# EAGLE design f1_Not (EAGLE 7.2.0)
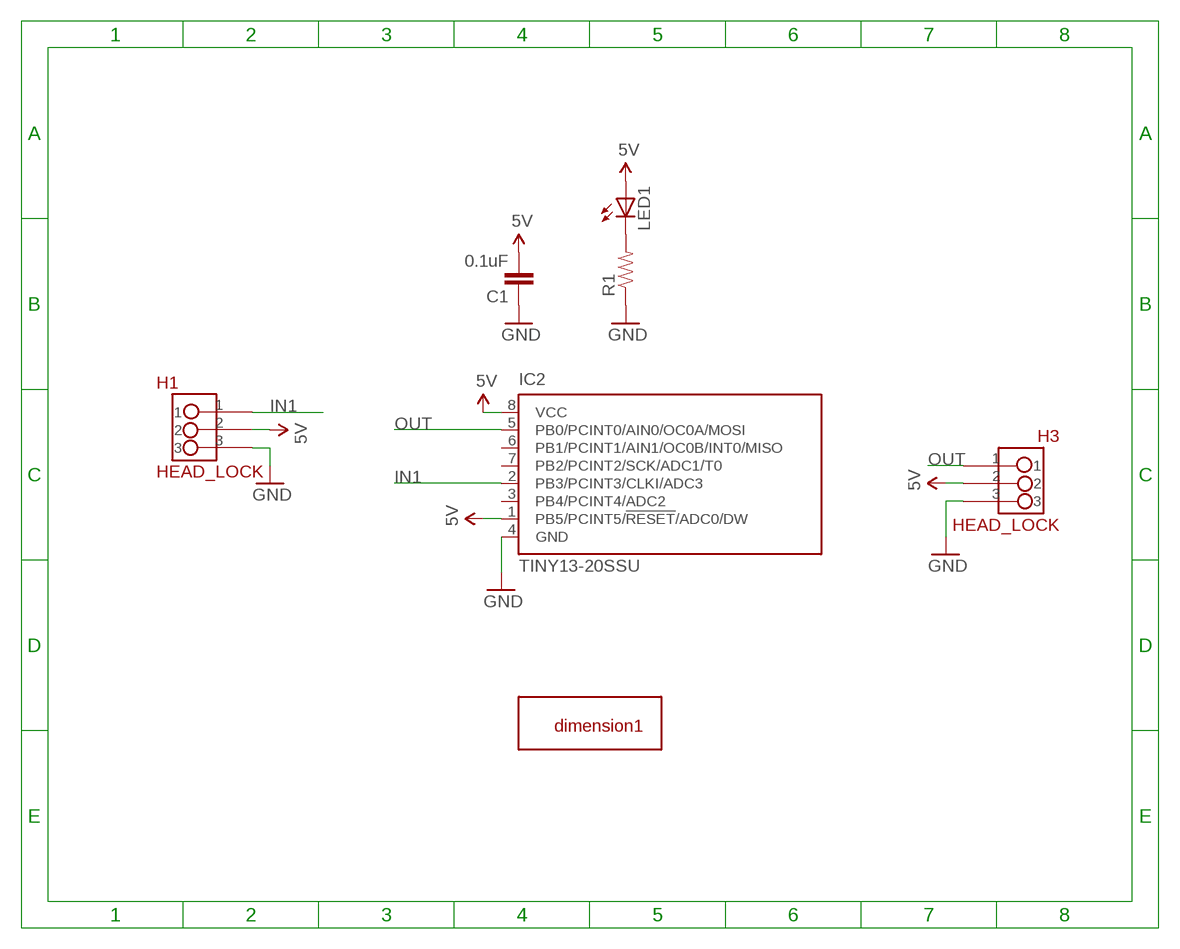
[diagram p0: schematic, sheet 1]

## Parts
C1  0.1uF  0.1UF-25V(+80/-20%)(0603)  [0603-CAP]
H1  HEAD_LOCK  [HEAD_LOCK]
H3  HEAD_LOCK  [HEAD_LOCK]
IC2  TINY13-20SSU  [8S1]
LED1  LEDSML0603  [SML0603]
R1  RESISTOR0603-RES  [0603-RES]
U$1  DIMENSION1  [DIMENSION1]

## Nets
5V: C1.2 H1.2 H3.2 IC2.1(PB5/PCINT5/!RESET!/ADC0/DW) IC2.8(VCC) LED1.A
GND: C1.1 H1.3 H3.3 IC2.4(GND) R1.1
IN1: H1.1 IC2.2(PB3/PCINT3/CLKI/ADC3)
N$1: LED1.C R1.2
OUT: H3.1 IC2.5(PB0/PCINT0/AIN0/OC0A/MOSI)
Unconnected: IC2.3(PB4/PCINT4/ADC2) IC2.6(PB1/PCINT1/AIN1/OC0B/INT0/MISO) IC2.7(PB2/PCINT2/SCK/ADC1/T0)

## Library data of the parts
C1 = SparkFun-Capacitors:0.1UF-25V(+80/-20%)(0603): CAP-00810 Ceramic Standard decoupling cap; PROD_ID: CAP-00810
H1 H3 = HEAD_LOCK:HEAD_LOCK: 带锁的排座
IC2 = atmel:TINY13: 8-bit AVR Microcontroller with 1K Bytes In-System Programmable Flash Source: http://www.atmel.com/dyn/resources/prod_documents/2535S.pdf; MPN: ATTINY13-20SSU; OC_FARNELL: 1455133; OC_NEWARK: 58M3771
LED1 = led:LED: LED OSRAM: - CHIPLED LG R971, LG N971, LY N971, LG Q971, LY Q971, LO R971, LY R971 LH N974, LH R974 LS Q976, LO Q976, LY Q976 LO Q996 - Hyper CHIPLED LW Q18S LB Q993, LB Q99A, LB R99A - SideLED LS A670, LO A670, LY A670, LG A670, LP A670 LB A673, LV A673, LT A673, LW A673 LH A674 LY A675 LS A676, LA A676, LO A676, LY A676, LW A676 LS A679, LY A679, LG A679 - Hyper Micro SIDELED® LS Y876, LA Y876, LO Y876, LY Y876 LT Y87S - SmartLED LW L88C, LW L88S LB L89C, LB L89S, LG L890 LS L89K, LO L89K, LY L89K LS L896, LA L896, LO L896, LY L896 - TOPLED LS T670, LO T670, LY T670, LG T670, LP T670 LSG T670, LSP T670, LSY T670, LOP T670, LYG T670 LG T671, LOG T671, LSG T671 LB T673, LV T673, LT T673, LW T673 LH T674 LS T676, LA T676, LO T676, LY T676, LB T676, LH T676, LSB T676, LW T676 LB T67C, LV T67C, LT T67C, LS T67K, LO T67K, LY T67K, LW E67C LS E67B, LA E67B, LO E67B, LY E67B, LB E67C, LV E67C, LT E67C LW T67C LS T679, LY T679, LG T679 LS T770, LO T770, LY T770, LG T770, LP T770 LB T773, LV T773, LT T773, LW T773 LH T774 LS E675, LA E675, LY E675, LS T675 LS T776, LA T776, LO T776, LY T776, LB T776 LHGB T686 LT T68C, LB T68C - Hyper Mini TOPLED® LB M676 - Mini TOPLED Santana® LG M470 LS M47K, LO M47K, LY M47K Source: http://www.osram.convergy.de LUXEON: - LUMILED® LXK2-PW12-R00, LXK2-PW12-S00, LXK2-PW14-U00, LXK2-PW14-V00 LXK2-PM12-R00, LXK2-PM12-S00, LXK2-PM14-U00 LXK2-PE12-Q00, LXK2-PE12-R00, LXK2-PE12-S00, LXK2-PE14-T00, LXK2-PE14-U00 LXK2-PB12-K00, LXK2-PB12-L00, LXK2-PB12-M00, LXK2-PB14-N00, LXK2-PB14-P00, LXK2-PB14-Q00 LXK2-PR12-L00, LXK2-PR12-M00, LXK2-PR14-Q00, LXK2-PR14-R00 LXK2-PD12-Q00, LXK2-PD12-R00, LXK2-PD12-S00 LXK2-PH12-R00, LXK2-PH12-S00 LXK2-PL12-P00, LXK2-PL12-Q00, LXK2-PL12-R00 Source: www.luxeon.com KINGBRIGHT: KA-3528ASYC Source: www.kingbright.com
R1 = SparkFun-Passives:RESISTOR: Resistor Basic schematic elements and footprints for 0603, 1206, and PTH resistors.
U$1 = Xmaker_yuhui:DIMENSION1

## Board
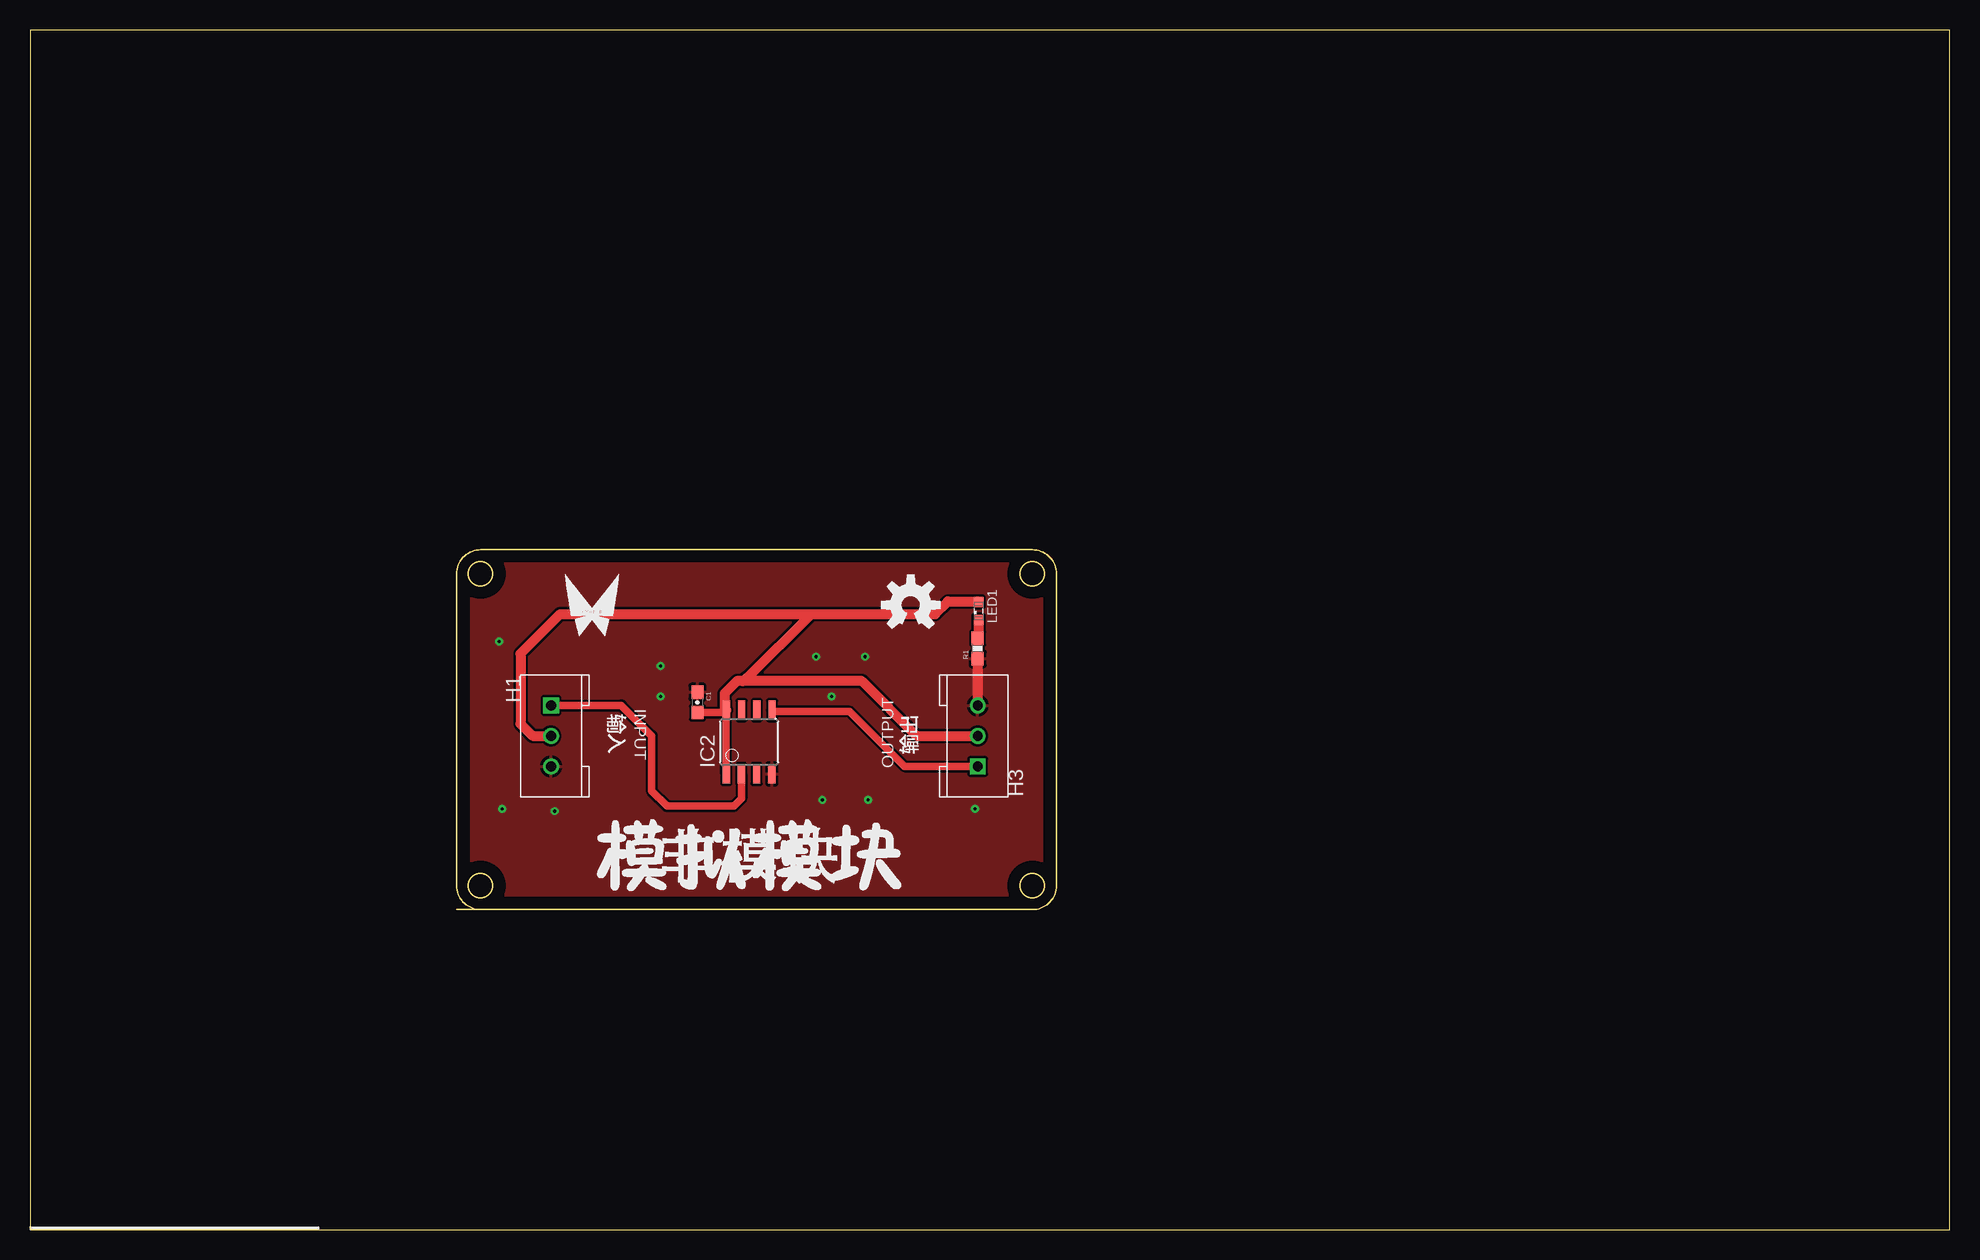
[diagram p1: board, top side]
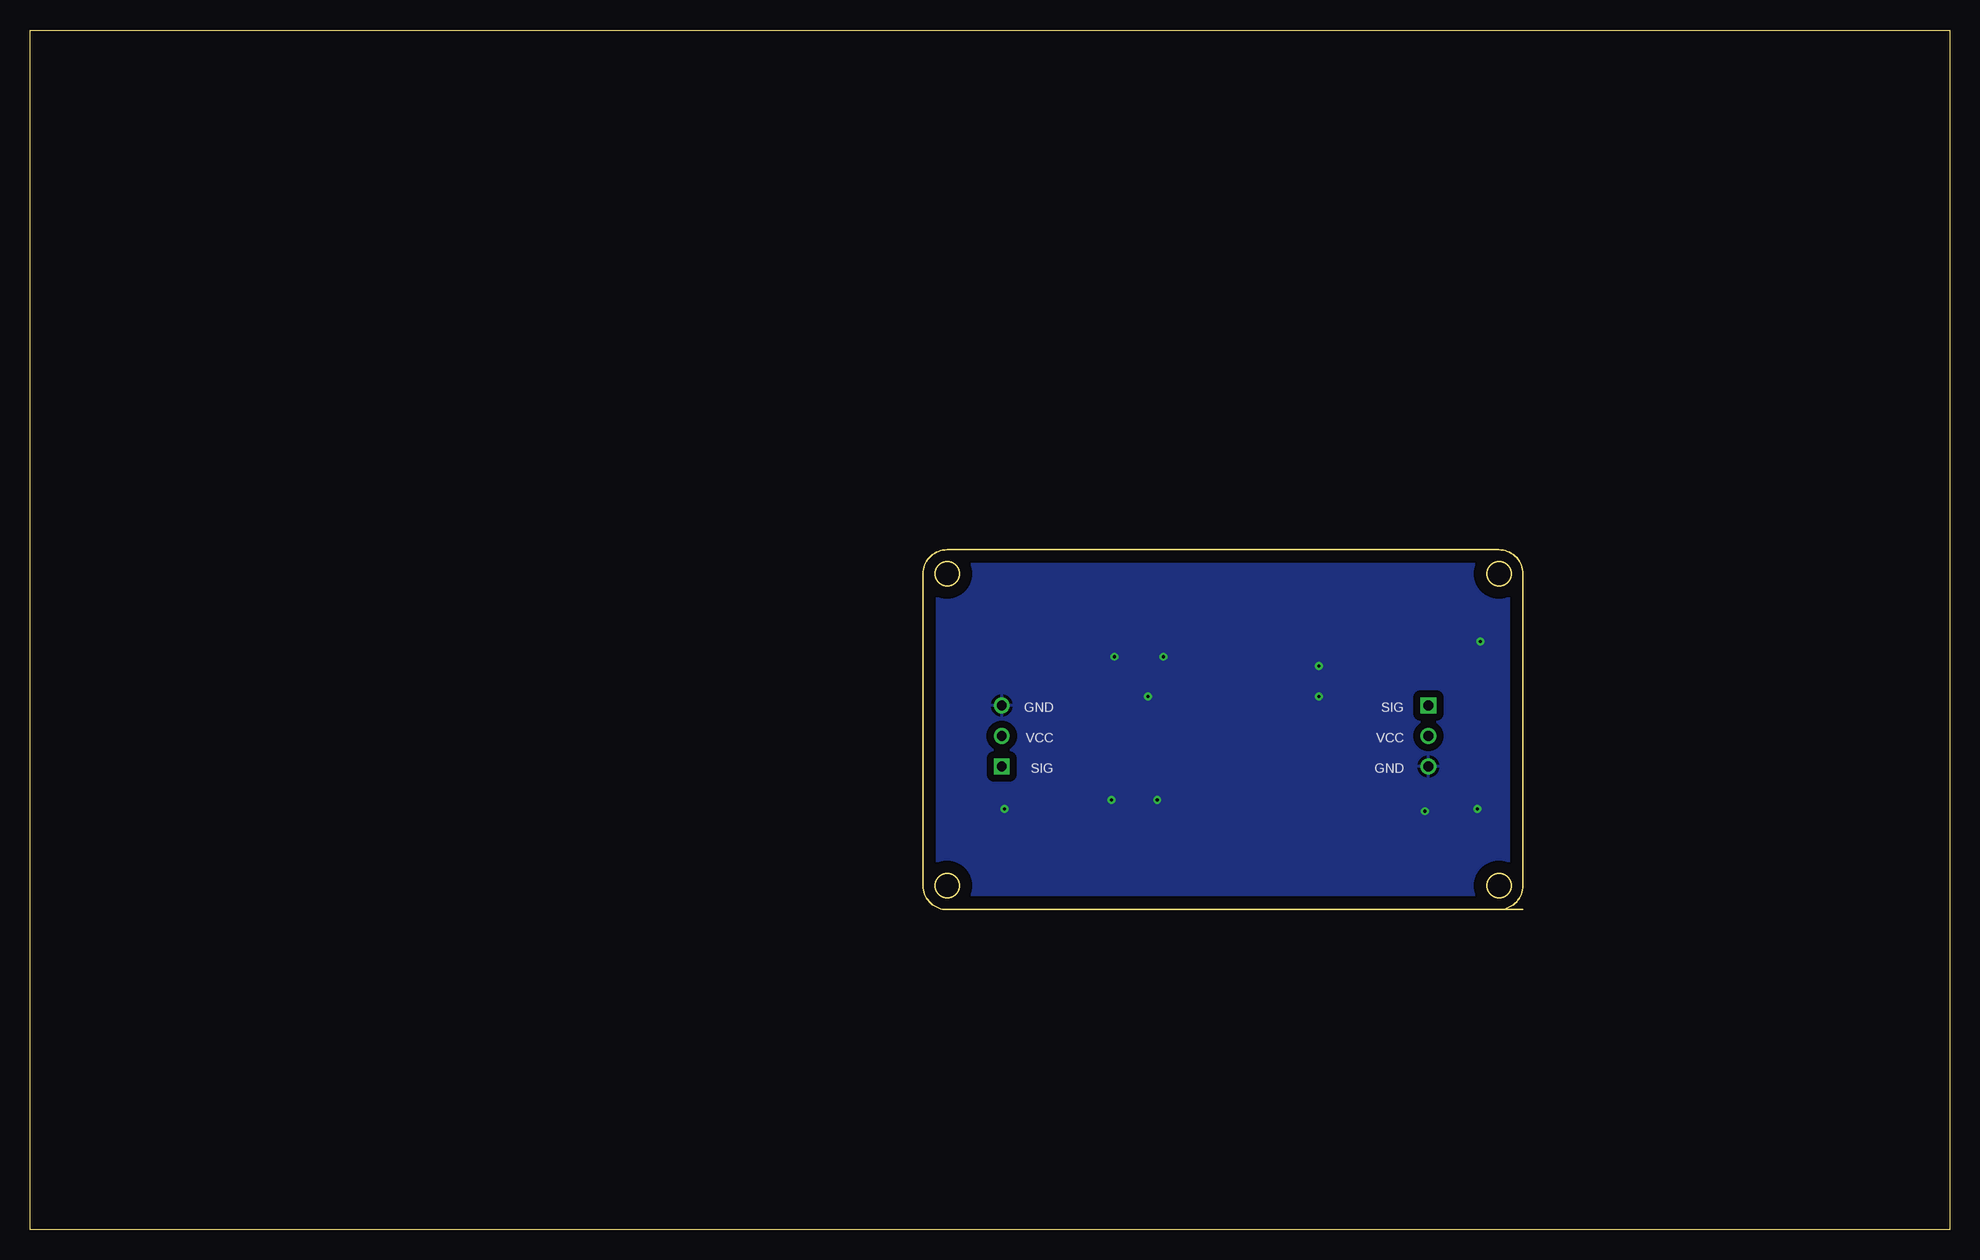
[diagram p2: board, bottom side, seen from below]

Size 160 x 100 mm. Coordinates in mm from the lower left corner, seen from the top.
Outline: 0,0 160,0 160,100 0,100 0,0
Copper layers (1*16): Top 0.035mm / dielectric 1.5mm / Bottom 0.035mm
Design rules "default": minimum track width 10mil, minimum drill 24mil, track to track 8mil, track to pad 8mil, pad to pad 8mil, via to via 8mil, smd to smd 8mil, copper to edge 40mil, drill to drill 8mil, minimum pad ring 10mil, minimum via ring 8mil, stop-mask expansion 4mil, vias tented up to drill 0mil, thermal gap 10mil

### Footprints (pad centres in the part's own frame; a part is rotated, then mirrored left to right if it is on the bottom)
0603-CAP = smd 1.1 x 1: 1 -0.85,0; 2 0.85,0
HEAD_LOCK = drill 0.8 square: 1 0,0 | drill 0.8: 2 2.54,0; 3 5.08,0
8S1 = smd 0.6 x 1.6: 1 -1.905,-2.654; 2 -0.645,-2.654; 3 0.625,-2.654; 4 1.895,-2.654; 5 1.905,2.654; 6 0.635,2.654; 7 -0.635,2.654; 8 -1.905,2.654
SML0603 = smd 0.8 x 0.8: A 0.75,0; C -0.75,0
0603-RES = smd 1.1 x 1: 1 -0.85,0; 2 0.85,0

### Placement (x,y rotation side)
C1  55.63,43.94 270 top
H1  43.43,43.69 270 top
H3  78.99,38.61 90 top
IC2  59.94,40.64 0 top
LED1  79.07,51.56 90 top
R1  78.99,48.44 90 top
U$1  35.56,26.67 0 top
U$2  [OSHW-LOGO-M]  73.41,52.07 0 top
U$3  [NAME_ANALOG]  60.45,27.79 0 top

### Tracks (layer width: path | path; a pad name or v marks a point on that pad's centre or on a via)
5V
  Top 0.61: IC2.1 IC2.8 57.84,43.09 C1.2 | 59.69,45.97 59.44,45.72
  Top 0.813: IC2.8 57.91,43.42 57.91,44.7 58.93,45.72 59.44,45.72 69.34,45.72 73.91,41.15 H3.2 | H1.2 41.91,41.15 40.89,42.16 40.89,48.01 44.2,51.31 65.13,51.31 | 65.13,51.31 75.44,51.31 76.5,52.38 79.01,52.38 LED1.A | 59.69,45.97 59.79,45.97 65.13,51.31
GND  (via drill 0.25)
  Top 0.813: R1.1 H3.3
  other vias: 39.12,49.02 39.37,35.05 52.58,46.99 52.58,44.45 66.04,35.81 69.85,35.81 43.71,34.87 78.77,35.08 66.8,44.45 65.53,47.75 69.6,47.75
  pour Bottom (isolate 0.61): 33.27,57.91 89.15,57.91 89.15,23.88 33.27,23.88
  pour Top: 33.27,57.91 89.15,57.91 89.15,23.88 33.27,23.88
IN1
  Top 0.61: IC2.2 59.3,35.93 58.67,35.31 53.09,35.31 51.82,36.58 51.82,41.15 49.28,43.69 H1.1
N$1
  Top 0.813: LED1.C 79.07,49.36 R1.2
OUT
  Top 0.61: IC2.5 61.96,43.18 68.33,43.18 72.9,38.61 H3.1

### Text on the board
tPlace: INPUT | OUTPUT | C:/Users/Xiangzi/Desktop/Ãû³Æ/XMAKER_PCB3.bmp | C:/Users/Xiangzi/Desktop/Ãû³Æ/XMAKER_PCB3.bmp | C:/Users/Xiangzi/Desktop/Ãû³Æ/XMAKER_PCB3.bmp | C:/Users/Xiangzi/Desktop/Ãû³Æ/·ÇÄ£¿é.bmp | C:/Users/Xiangzi/Desktop/Ãû³Æ/·ÇÄ£¿é.bmp | C:/Users/Xiangzi/Desktop/Ãû³Æ/Êä³ö.bmp | C:/Users/Xiangzi/Desktop/Ãû³Æ/ÊäÈë.bmp
bPlace: SIG | GND | VCC | VCC | GND | SIG